# EAGLE schematic sch (EAGLE 8.3.2)
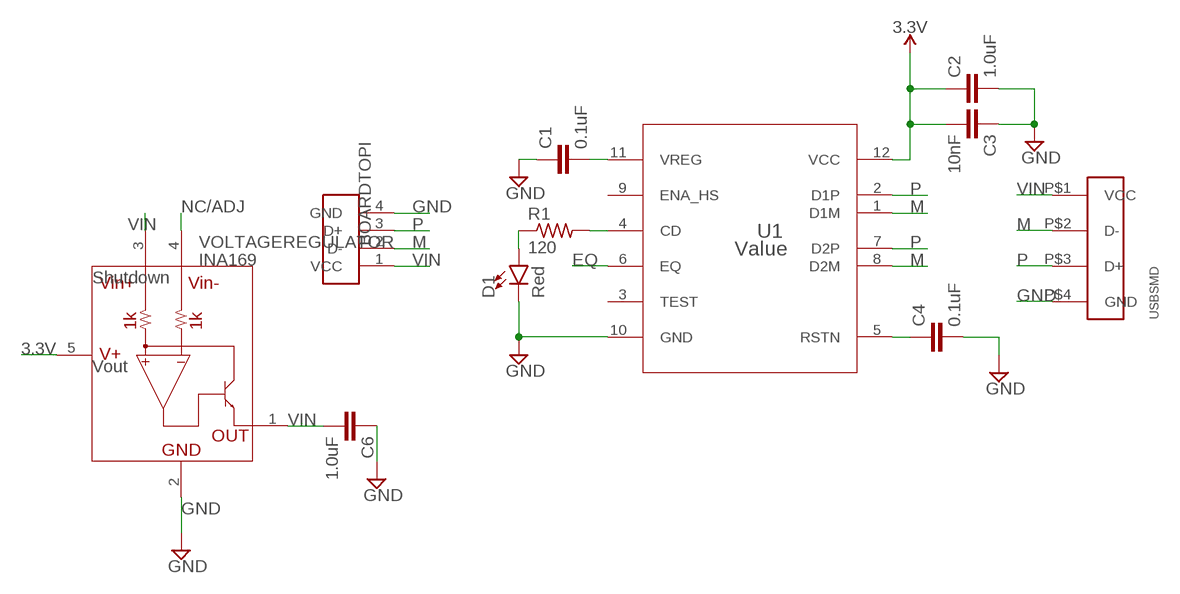
[diagram p0: schematic, sheet 1]

## Parts
BOARDTOPI  USBPCB  [USBPCB]
C1  0.1uF  0.1UF-0603-25V-(+80/-20%)  [0603]
C2  1.0uF  1.0UF-0603-16V-10%  [0603]
C3  10nF  10NF-0603-50V-10%  [0603]
C4  0.1uF  0.1UF-0603-25V-(+80/-20%)  [0603]
C6  1.0uF  1.0UF-0603-16V-10%  [0603]
D1  Red  LED-RED0603-SMART  [LED-0603]
R1  120  R-US_R0805  [R0805]
U1  Value  TUSB211RWBR  [RWB0012A]
USBSMD  USB  [USBSMD]
VOLTAGEREGULATOR  INA169  [SOT23-5]

## Nets
3.3V: C2.1 C3.2 U1.12(VCC) VOLTAGEREGULATOR.5(V+)
EQ: U1.6(EQ)
GND: BOARDTOPI.4(GND) C1.1 C2.2 C3.1 C4.2 C6.1 D1.C U1.10(GND) USBSMD.P$4(GND) VOLTAGEREGULATOR.2(GND)
M: BOARDTOPI.2(D-) U1.1(D1M) U1.8(D2M) USBSMD.P$2(D-)
N$1: C1.2 U1.11(VREG)
N$2: D1.A R1.1
N$3: R1.2 U1.4(CD)
N$4: C4.1 U1.5(RSTN)
NC/ADJ: VOLTAGEREGULATOR.4(VIN-)
P: BOARDTOPI.3(D+) U1.2(D1P) U1.7(D2P) USBSMD.P$3(D+)
VIN: BOARDTOPI.1(VCC) C6.2 USBSMD.P$1(VCC) VOLTAGEREGULATOR.1(OUT) VOLTAGEREGULATOR.3(VIN+)
Unconnected: U1.3(TEST) U1.9(ENA_HS)

## Notes on the sheet
- Shutdown
- Vout

## Library data of the parts
BOARDTOPI = USBPCB:USBPCB
C1 C4 = SparkFun-Capacitors:0.1UF: 0.1µF ceramic capacitors A capacitor is a passive two-terminal electrical component used to store electrical energy temporarily in an electric field.; PROD_ID: CAP-00810
C2 C6 = SparkFun-Capacitors:1.0UF: 1µF ceramic capacitors A capacitor is a passive two-terminal electrical component used to store electrical energy temporarily in an electric field.; PROD_ID: CAP-00868
C3 = SparkFun-Capacitors:10NF: 0.01uF/10nF/10,000pF ceramic capacitors A capacitor is a passive two-terminal electrical component used to store electrical energy temporarily in an electric field. CAP-09321; PROD_ID: CAP-00867
D1 = SparkFun-LED:LED-RED: Red SMD LED Used in manufacturing of most products at SparkFun Packages: 0603 - SMD 0603 package [Product Link] <http://docs.avagotech.com/docs/AV02-0551EN> 0603 SMART - SMD 0603 SMART package ( more efficient and expensive)[Product Link] <http://www.osram-os.com/Graphics/XPic2/00077099_0.pdf> 1206 - SMD1206 package [Product Link] <https://www.sparkfun.com/datasheets/DevTools/LilyPad/Q150OVS4.pdff> SparkFun Products: Pro Mini 328 -5V <https://www.sparkfun.com/products/821> RedBoard <https://www.sparkfun.com/products/12757> IOIO-OTG <https://www.sparkfun.com/products/13613>; PROD_ID: DIO-11154
R1 = rcl:R-US_: RESISTOR, American symbol
U1 = TUSB211:TUSB211RWBR; COMPTYPE: IC; MANUFACTURER: Texas Instruments; MOUNTTYPE: SMT; PACKAGEREFERENCE: RWB0012A; PARTNUMBER: TUSB211QRWBR; PIN_COUNT: 12; REFDES: RefDes; ROHS: Y; TYPE: TYPE
USBSMD = USBSMD:USB
VOLTAGEREGULATOR = SparkFun-IC-Special-Function:INA169: Current Output Current Shunt Monitor 0.5%, SOT23-5 Datasheet <http://cdn.sparkfun.com/datasheets/Sensors/Current/ina169.pdf> SparkFun Products SparkFun Current Sensor Breakout - INA169 <https://www.sparkfun.com/products/12040> (SEN-12040); PROD_ID: IC-11776